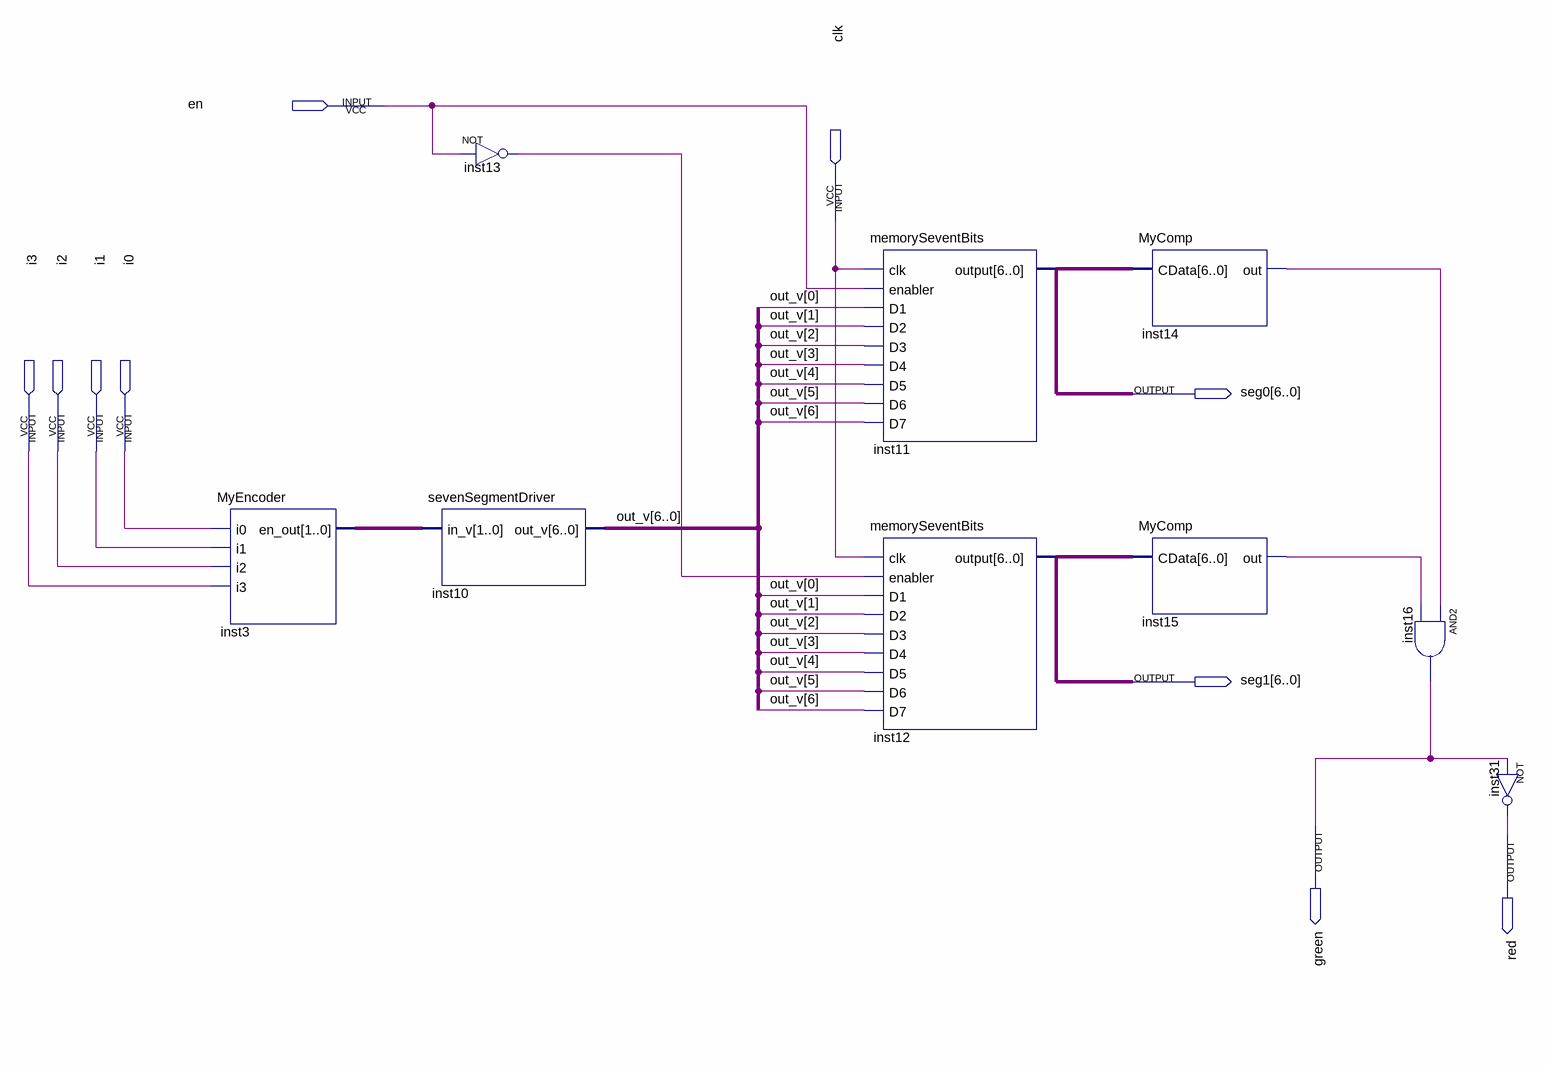
[diagram p0: schematic sheet]
// Quartus schematic security_system.bdf as structural Verilog: 9 symbols, 10 pins
module security_system (
  input  en,
  input  clk,
  input  i3,
  input  i2,
  input  i1,
  input  i0,
  output [6:0] seg0,
  output [6:0] seg1,
  output green,
  output red
);

  wire inst13_out, inst14_out, inst15_out;
  wire [1:0] inst3_en_out;
  wire [6:0] out_v;

  MyEncoder inst3 (.i0(i0), .i1(i1), .i2(i2), .i3(i3), .en_out(inst3_en_out));
  sevenSegmentDriver inst10 (.in_v(inst3_en_out), .out_v(out_v));
  not inst13 (inst13_out, en);
  memorySeventBits inst11 (
    .clk(clk), .enabler(en), .D1(out_v[0]), .D2(out_v[1]), .D3(out_v[2]), .D4(out_v[3]), .D5(out_v[4]),
    .D6(out_v[5]), .D7(out_v[6]), .\output (seg0));
  memorySeventBits inst12 (
    .clk(clk), .enabler(inst13_out), .D1(out_v[0]), .D2(out_v[1]), .D3(out_v[2]), .D4(out_v[3]),
    .D5(out_v[4]), .D6(out_v[5]), .D7(out_v[6]), .\output (seg1));
  MyComp inst14 (.CData(seg0), .out(inst14_out));
  MyComp inst15 (.CData(seg1), .out(inst15_out));
  and inst16 (green, inst14_out, inst15_out);
  not inst31 (red, green);
endmodule
